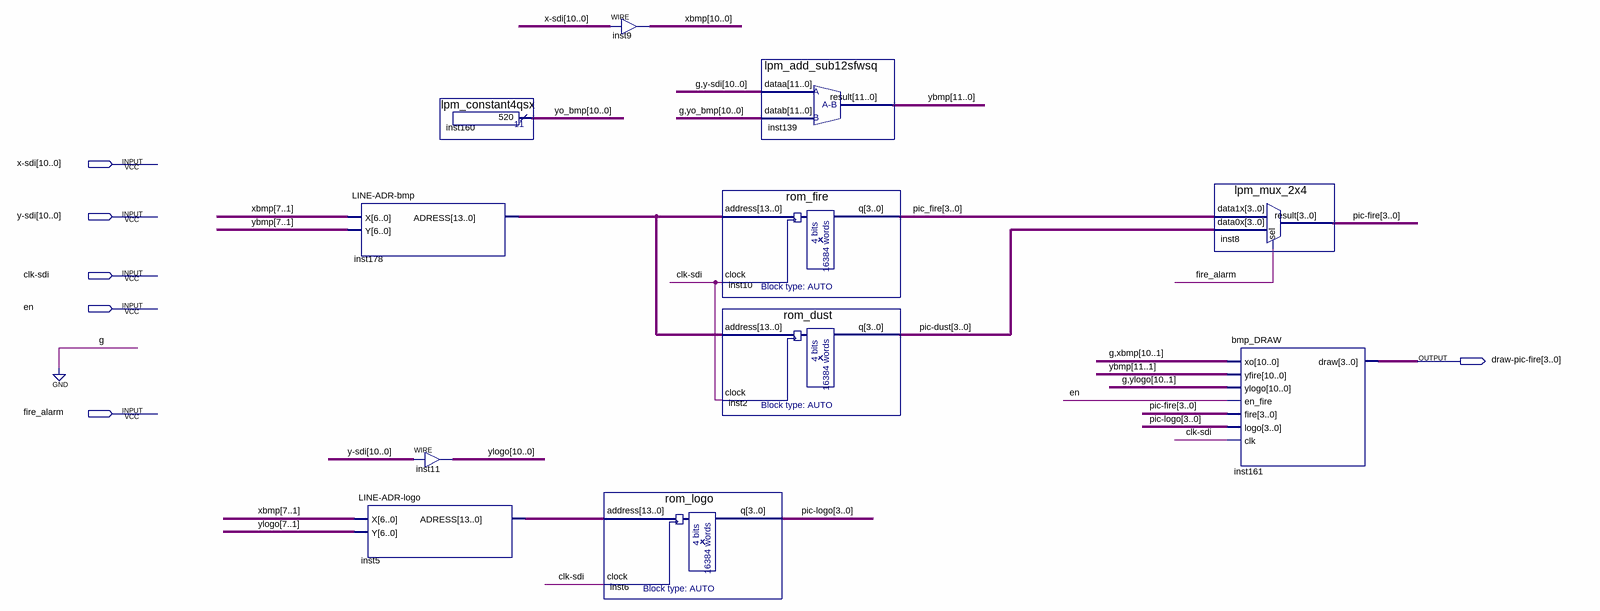
[diagram p0: schematic sheet]
// Quartus schematic Draw_alarm.bdf as structural Verilog: 11 symbols, 6 pins
module Draw_alarm (
  input  [10:0] \x-sdi ,
  input  [10:0] \y-sdi ,
  input  \clk-sdi ,
  input  en,
  input  fire_alarm,
  output [3:0] \draw-pic-fire 
);

  wire [3:0] \pic-dust , \pic-fire , \pic-logo , pic_fire;
  wire [10:0] xbmp, ylogo, yo_bmp;
  wire [11:0] ybmp;
  wire [13:0] inst5_adress, inst178_adress;

  \LINE-ADR-bmp  inst178 (.X(xbmp[7:1]), .Y(ybmp[7:1]), .ADRESS(inst178_adress));
  \LINE-ADR-logo  inst5 (.X(xbmp[7:1]), .Y(ylogo[7:1]), .ADRESS(inst5_adress));
  lpm_constant4qsx inst160 (.result(yo_bmp));
  assign ylogo = \y-sdi ;  // WIRE inst11
  assign xbmp = \x-sdi ;  // WIRE inst9
  rom_logo inst6 (.address(inst5_adress), .clock(\clk-sdi ), .q(\pic-logo ));
  rom_fire inst10 (.address(inst178_adress), .clock(\clk-sdi ), .q(pic_fire));
  rom_dust inst2 (.address(inst178_adress), .clock(\clk-sdi ), .q(\pic-dust ));
  lpm_add_sub12sfwsq inst139 (.dataa({1'b0, \y-sdi }), .datab({1'b0, yo_bmp}), .result(ybmp));
  lpm_mux_2x4 inst8 (.data1x(pic_fire), .data0x(\pic-dust ), .sel(fire_alarm), .result(\pic-fire ));
  bmp_DRAW inst161 (
    .xo({1'b0, xbmp[10:1]}), .yfire(ybmp[11:1]), .ylogo({1'b0, ylogo[10:1]}), .en_fire(en),
    .fire(\pic-fire ), .logo(\pic-logo ), .clk(\clk-sdi ), .draw(\draw-pic-fire ));
endmodule
